# Altium schematic sheet D_Output.SchDoc
size A4; SheetNumber: 8; SheetTotal: 9
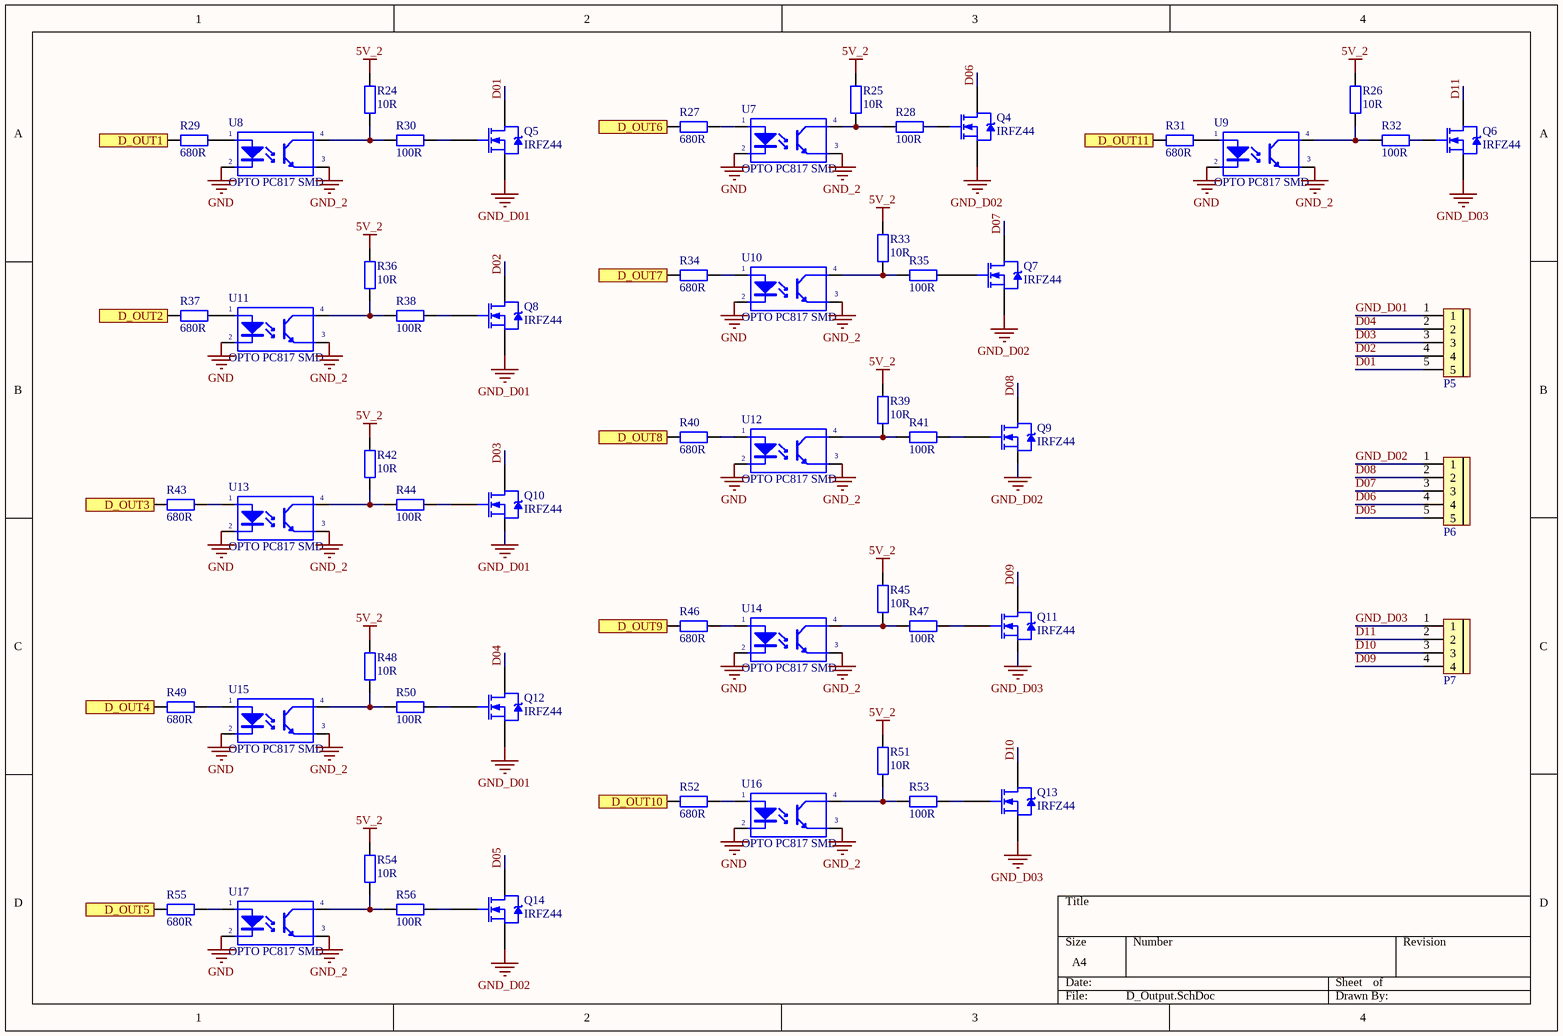
[diagram p0: D_Output.SchDoc]

## Parts
P5  CON 5 EDG5.08  [CON 5 5EDG5.08]  (value not drawn)
P6  CON 5 EDG5.08  [CON 5 5EDG5.08]  (value not drawn)
P7  CON 4 EDG5.08  [CON 4 4EDG5.08]  (value not drawn)
Q4  IRFZ44  [TO220]
Q5  IRFZ44  [TO220]
Q6  IRFZ44  [TO220]
Q7  IRFZ44  [TO220]
Q8  IRFZ44  [TO220]
Q9  IRFZ44  [TO220]
Q10  IRFZ44  [TO220]
Q11  IRFZ44  [TO220]
Q12  IRFZ44  [TO220]
Q13  IRFZ44  [TO220]
Q14  IRFZ44  [TO220]
R24  10R  [Tro smd 0603]
R25  10R  [Tro smd 0603]
R26  10R  [Tro smd 0603]
R27  680R  [tro smd 0603]
R28  100R  [tro smd 0603]
R29  680R  [tro smd 0603]
R30  100R  [tro smd 0603]
R31  680R  [tro smd 0603]
R32  100R  [tro smd 0603]
R33  10R  [Tro smd 0603]
R34  680R  [tro smd 0603]
R35  100R  [tro smd 0603]
R36  10R  [Tro smd 0603]
R37  680R  [tro smd 0603]
R38  100R  [tro smd 0603]
R39  10R  [Tro smd 0603]
R40  680R  [tro smd 0603]
R41  100R  [tro smd 0603]
R42  10R  [Tro smd 0603]
R43  680R  [tro smd 0603]
R44  100R  [tro smd 0603]
R45  10R  [Tro smd 0603]
R46  680R  [tro smd 0603]
R47  100R  [tro smd 0603]
R48  10R  [Tro smd 0603]
R49  680R  [tro smd 0603]
R50  100R  [tro smd 0603]
R51  10R  [Tro smd 0603]
R52  680R  [tro smd 0603]
R53  100R  [tro smd 0603]
R54  10R  [Tro smd 0603]
R55  680R  [tro smd 0603]
R56  100R  [tro smd 0603]
U7  OPTO PC817 SMD  [SOP4]
U8  OPTO PC817 SMD  [SOP4]
U9  OPTO PC817 SMD  [SOP4]
U10  OPTO PC817 SMD  [SOP4]
U11  OPTO PC817 SMD  [SOP4]
U12  OPTO PC817 SMD  [SOP4]
U13  OPTO PC817 SMD  [SOP4]
U14  OPTO PC817 SMD  [SOP4]
U15  OPTO PC817 SMD  [SOP4]
U16  OPTO PC817 SMD  [SOP4]
U17  OPTO PC817 SMD  [SOP4]

## Ports
D_OUT1 (in), D_OUT2 (in), D_OUT3 (in), D_OUT4 (in), D_OUT5 (in), D_OUT6 (in), D_OUT7 (in), D_OUT8 (in), D_OUT9 (in), D_OUT10 (in), D_OUT11 (in)

## Nets
5V_2: R24.2 R25.2 R26.2 R33.2 R36.2 R39.2 R42.2 R45.2 R48.2 R51.2 R54.2
GND: U7.2(K) U8.2(K) U9.2(K) U10.2(K) U11.2(K) U12.2(K) U13.2(K) U14.2(K) U15.2(K) U16.2(K) U17.2(K)
GND_2: U7.3(E) U8.3(E) U9.3(E) U10.3(E) U11.3(E) U12.3(E) U13.3(E) U14.3(E) U15.3(E) U16.3(E) U17.3(E)
GND_D01: P5.1 Q5.3(S) Q8.3(S) Q10.3(S) Q12.3(S)
GND_D02: P6.1 Q4.3(S) Q7.3(S) Q9.3(S) Q14.3(S)
GND_D03: P7.1 Q6.3(S) Q11.3(S) Q13.3(S)
D01: P5.5 Q5.2(D)
D02: P5.4 Q8.2(D)
D03: P5.3 Q10.2(D)
D04: P5.2 Q12.2(D)
D05: P6.5 Q14.2(D)
D06: P6.4 Q4.2(D)
D07: P6.3 Q7.2(D)
D08: P6.2 Q9.2(D)
D09: P7.4 Q11.2(D)
D10: P7.3 Q13.2(D)
D11: P7.2 Q6.2(D)
D_OUT1: R29.1 ; port D_OUT1
D_OUT2: R37.1 ; port D_OUT2
D_OUT3: R43.1 ; port D_OUT3
D_OUT4: R49.1 ; port D_OUT4
D_OUT5: R55.1 ; port D_OUT5
D_OUT6: R27.1 ; port D_OUT6
D_OUT7: R34.1 ; port D_OUT7
D_OUT8: R40.1 ; port D_OUT8
D_OUT9: R46.1 ; port D_OUT9
D_OUT10: R52.1 ; port D_OUT10
D_OUT11: R31.1 ; port D_OUT11
NetQ4_1: Q4.1(G) R28.2
NetQ5_1: Q5.1(G) R30.2
NetQ6_1: Q6.1(G) R32.2
NetQ7_1: Q7.1(G) R35.2
NetQ8_1: Q8.1(G) R38.2
NetQ9_1: Q9.1(G) R41.2
NetQ10_1: Q10.1(G) R44.2
NetQ11_1: Q11.1(G) R47.2
NetQ12_1: Q12.1(G) R50.2
NetQ13_1: Q13.1(G) R53.2
NetQ14_1: Q14.1(G) R56.2
NetR24_1: R24.1 R30.1 U8.4(C)
NetR25_1: R25.1 R28.1 U7.4(C)
NetR26_1: R26.1 R32.1 U9.4(C)
NetR27_2: R27.2 U7.1(A)
NetR29_2: R29.2 U8.1(A)
NetR31_2: R31.2 U9.1(A)
NetR33_1: R33.1 R35.1 U10.4(C)
NetR34_2: R34.2 U10.1(A)
NetR36_1: R36.1 R38.1 U11.4(C)
NetR37_2: R37.2 U11.1(A)
NetR39_1: R39.1 R41.1 U12.4(C)
NetR40_2: R40.2 U12.1(A)
NetR42_1: R42.1 R44.1 U13.4(C)
NetR43_2: R43.2 U13.1(A)
NetR45_1: R45.1 R47.1 U14.4(C)
NetR46_2: R46.2 U14.1(A)
NetR48_1: R48.1 R50.1 U15.4(C)
NetR49_2: R49.2 U15.1(A)
NetR51_1: R51.1 R53.1 U16.4(C)
NetR52_2: R52.2 U16.1(A)
NetR54_1: R54.1 R56.1 U17.4(C)
NetR55_2: R55.2 U17.1(A)

## Library data of the parts
P5 P6 = CON 5 EDG5.08: Cắm; Ten_Linh_Kien: CON 5 2EDG5.08-5P 5.08MM ( Xanh Cong); Ma_Hang: MH003589; Kieu_Chan: *; Don_Vi: Con; Ghi_Chu: *; Chung_Loai: Cắm
P7 = CON 4 EDG5.08: Cắm; Ten_Linh_Kien: CON 4 2EDG5.08-4P 5.08MM ( Xanh Cong); Ma_Hang: MH000979; Don_Vi: Con; Ghi_Chu: *; Kieu_Chan: *; Chung_Loai: Cắm
Q4-Q14 = IRFZ44 DIP: N-Channel Power MOSFET
R24-R26 R33 R36 R39 R42 R45 R48 R51 R54 = Tro 0603 5% 10R: Dán; So_Chan: 2; Ten_Linh_Kien: Trở 0603 5% 10R; Ma_Hang: MH006317; Don_Vi: Con; Chung_Loai: Dán; Kieu_Chan: *
R27 R29 R31 R34 R37 R40 R43 R46 R49 R52 R55 = Tro 0603 1% 680R: Dán; Don_Vi: Con; So_Chan: 2; Ten_Linh_Kien: Trở 0603 1% 680R; Ma_Hang: MH006336; Chung_Loai: Dán; Kieu_Chan: *
R28 R30 R32 R35 R38 R41 R44 R47 R50 R53 R56 = Tro 0603 5% 100R: Dán; Don_Vi: Con; So_Chan: 2; Ten_Linh_Kien: Trở 0603 5% 100R; Ma_Hang: MH006315; Chung_Loai: Dán; Kieu_Chan: *
U7-U17 = OPTO PC817 SMD: Single Opto; Value: PC817